# EAGLE design Sensor hall (EAGLE 9.6.0)
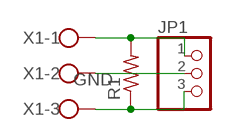
[diagram p0: schematic, sheet 1]

## Parts
JP1  PINHD-1X3  [1X03]
R1  R-US_0411/15  [0411/15]
X1  W237-103  [W237-103]

## Nets
GND: JP1.2 X1.2
N$1: JP1.1 R1.2 X1.1
N$2: JP1.3 R1.1 X1.3

## Library data of the parts
JP1 = pinhead:PINHD-1X3: PIN HEADER
R1 = rcl:R-US_: RESISTOR, American symbol; SPICEPREFIX: R
X1 = con-wago-500:W237-103: WAGO SCREW CLAMP; MPN: 237-103; OC_FARNELL: unknown; OC_NEWARK: 18M7116

## Board
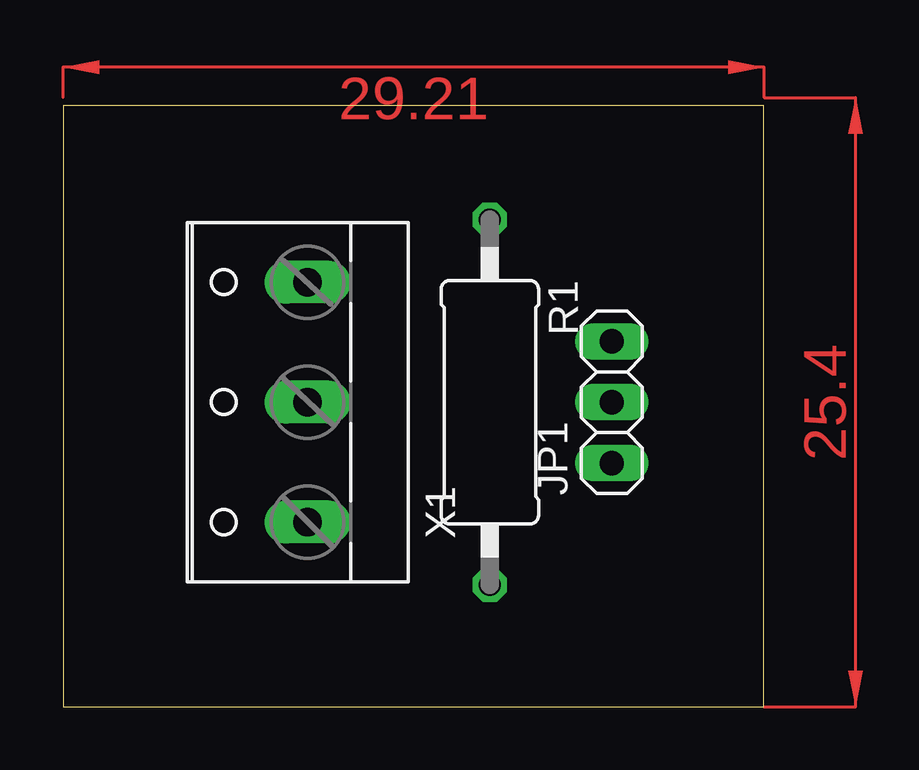
[diagram p1: board, top side]
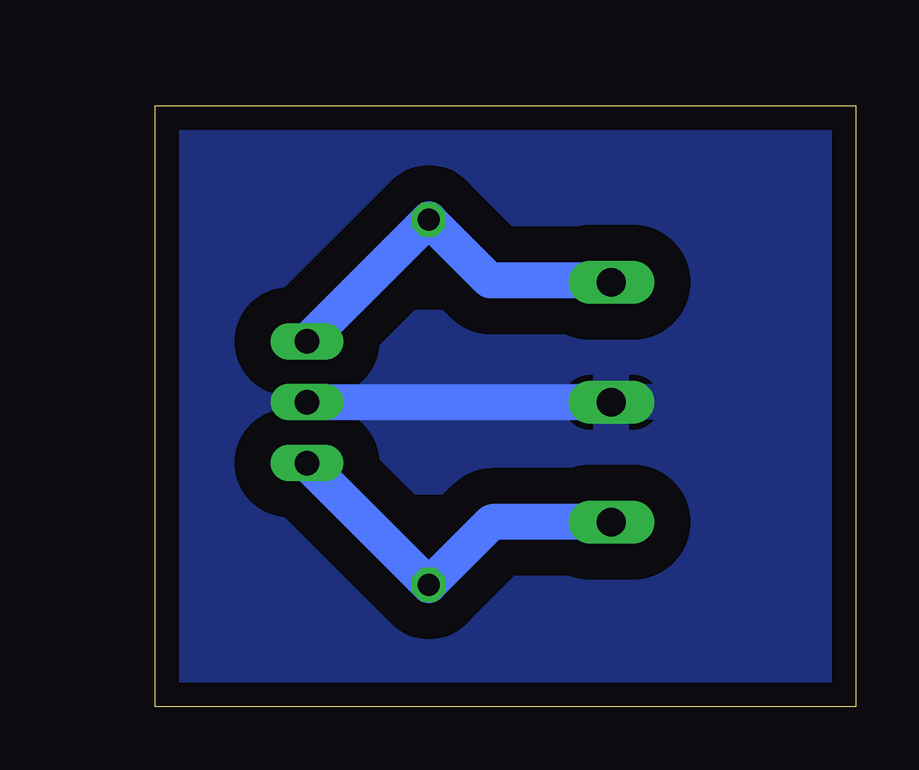
[diagram p2: board, bottom side, seen from below]

Size 29.19 x 25.07 mm. Coordinates in mm from the lower left corner, seen from the top.
Outline: 0,0 29.19,0 29.19,25.07 0,25.07 0,0
Copper layers (1*16): Top 0.035mm / dielectric 1.5mm / Bottom 0.035mm
Design rules "default *": minimum track width 1.5mm, minimum drill 0.35mm, track to track 1.5mm, track to pad 1.5mm, pad to pad 1.5mm, via to via 1.5mm, smd to smd 6mil, copper to edge 1mm, drill to drill 6mil, minimum pad ring 10mil, minimum via ring 8mil, stop-mask expansion 4mil, vias tented up to drill 0mil, thermal gap 10mil

### Footprints (pad centres in the part's own frame; a part is rotated, then mirrored left to right if it is on the bottom)
1X03 = drill 1.016 long: 1 -2.54,0; 2 0,0; 3 2.54,0
0411/15 = drill 0.914 octagon: 1 -7.62,0; 2 7.62,0
W237-103 = drill 1.194 long: 1 -5,-1.29; 2 0,-1.29; 3 5,-1.29

### Placement (x,y rotation side)
JP1  22.86,12.7 90 top
R1  17.78,12.7 270 top
X1  8.89,12.7 90 top

### Tracks (layer width: path | path; a pad name or v marks a point on that pad's centre or on a via)
GND
  Bottom 1.5: JP1.2 X1.2
  pour Bottom: 0,0 29.21,0 29.21,25.4 0,25.4
N$1
  Bottom 1.5: JP1.1 R1.2 15.16,7.7 X1.1
N$2
  Bottom 1.5: X1.3 10.26,17.78 15.24,17.78 R1.1 JP1.3
(copper drawn outside any net)
  shapes: Top area x2